# Altium schematic sheet DM2080_Connector_B.SchDoc: =project_title
size Tabloid; CompanyName: Luxonis Holding; Organization: Luxonis Holding; Address1: 1925 Harmony Park Drive; Address2: Westminster, CO; Address3: 80234; Address4: United States; SheetNumber: 3; SheetTotal: 12
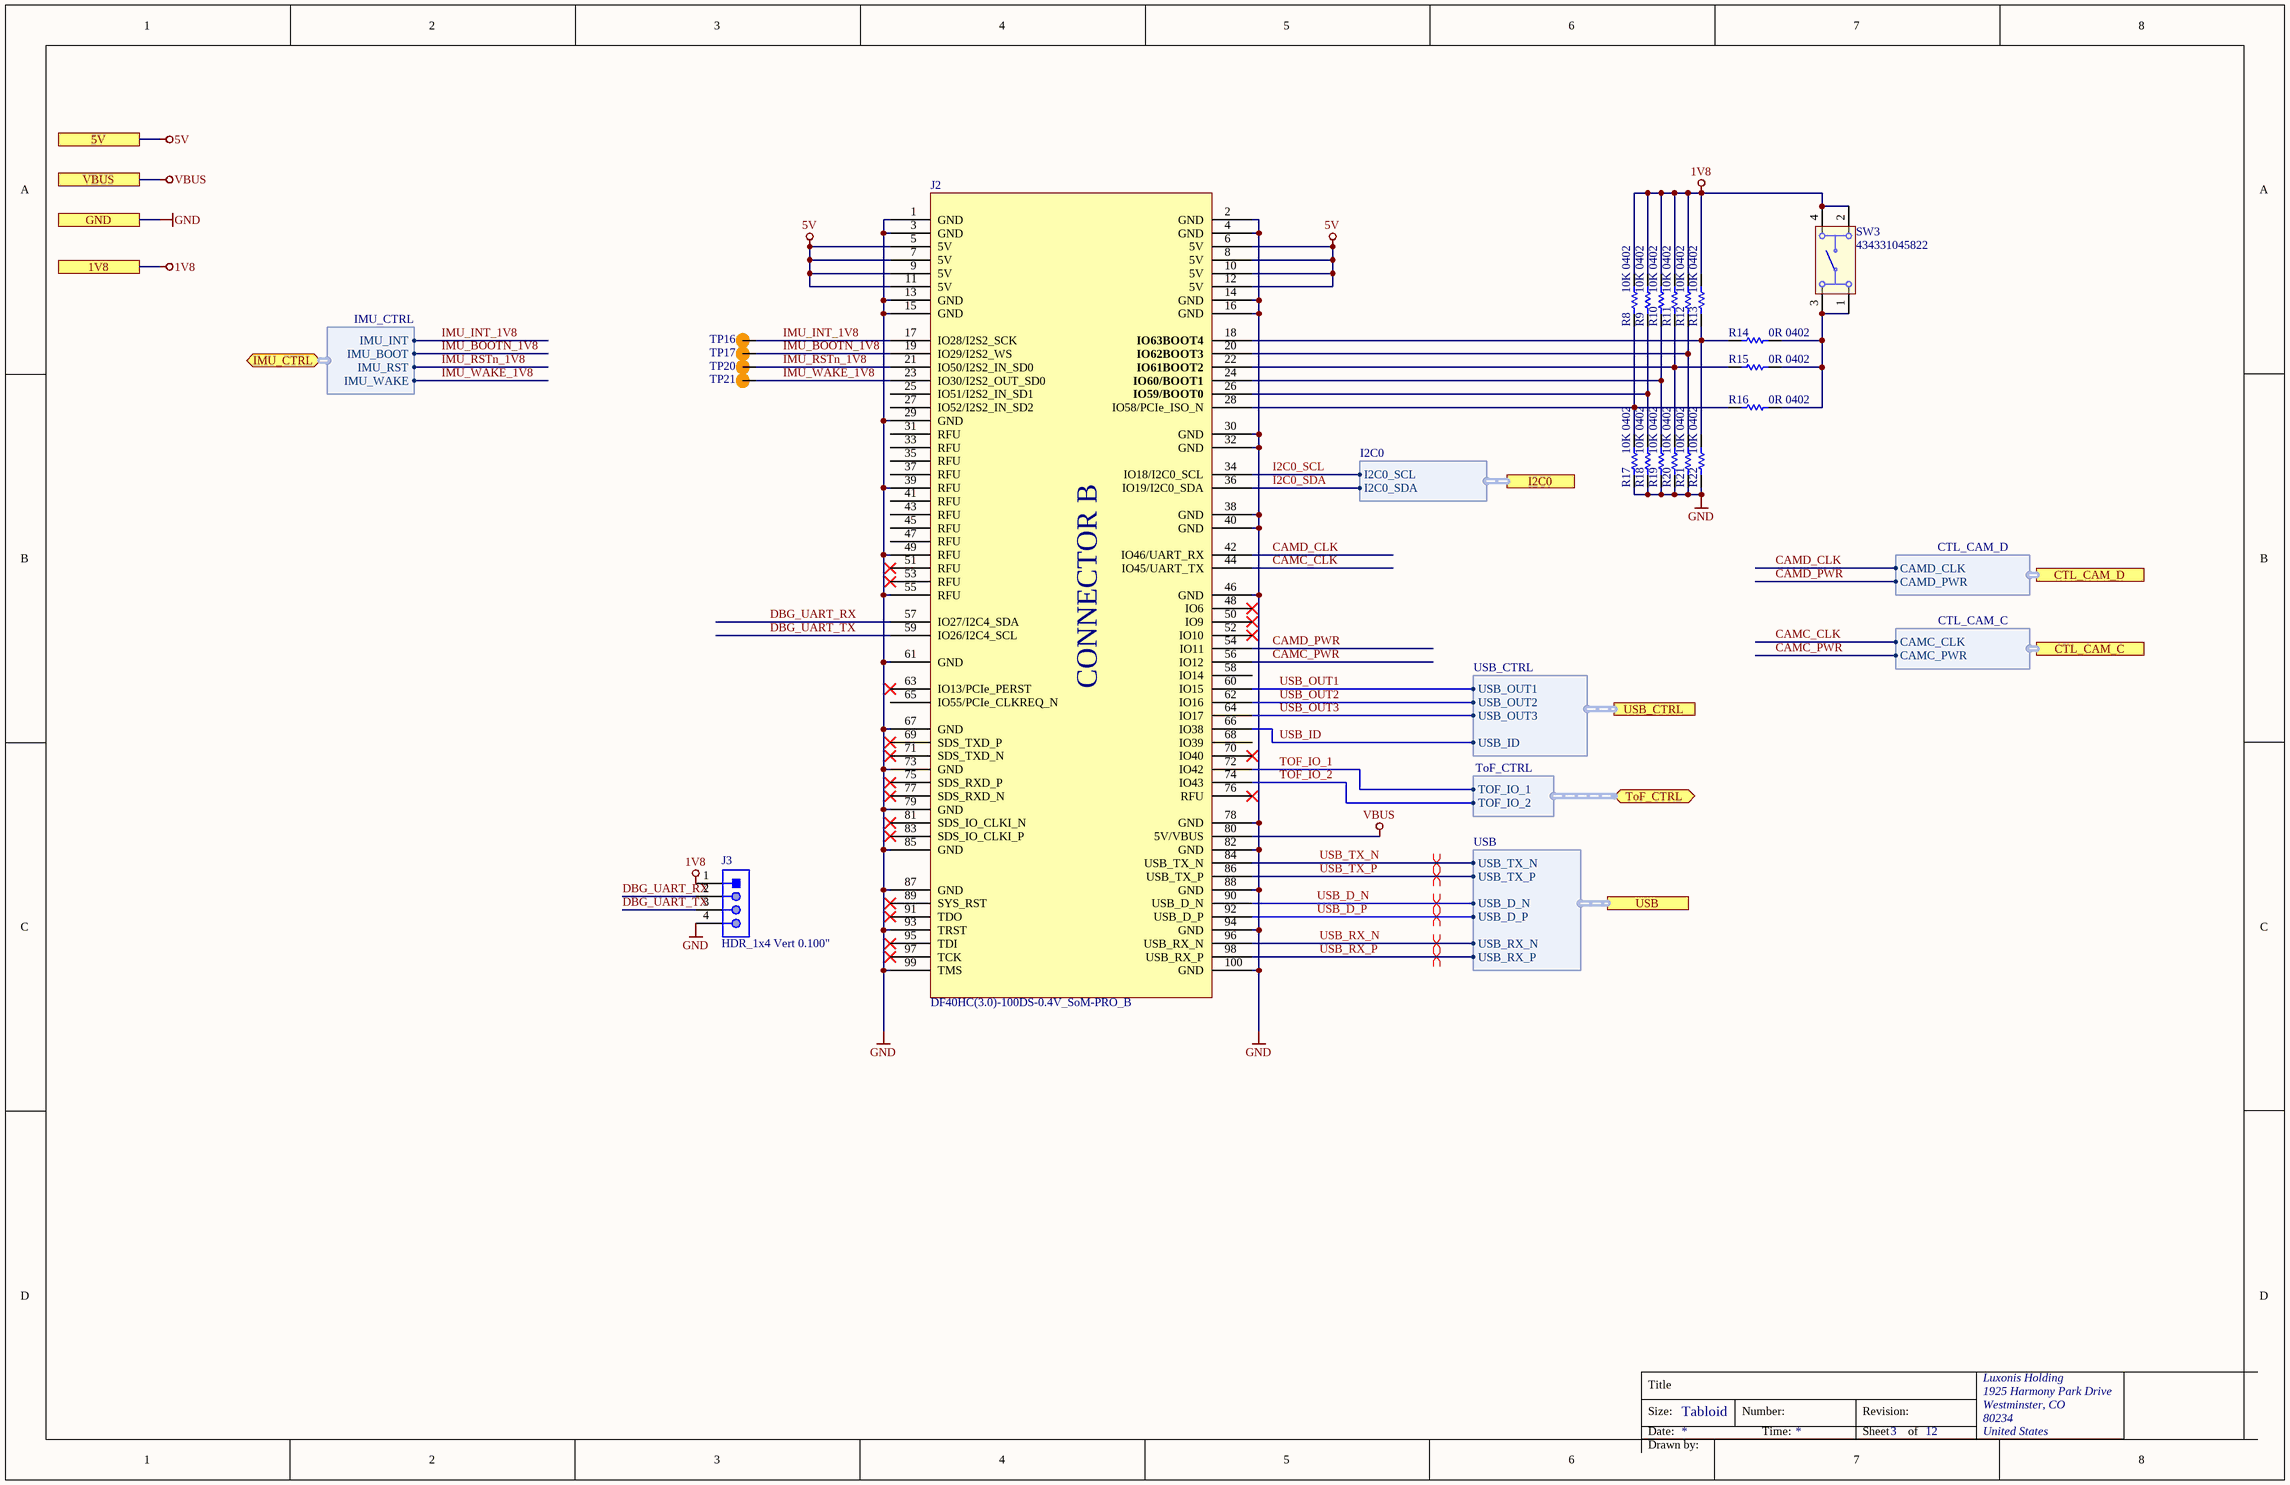
[diagram p0: DM2080_Connector_B.SchDoc]

## Parts
J2  DF40HC(3.0)-100DS-0.4V_SoM-PRO_B  [CON_B_BW2099_SoM_DF40HC-3.0-100DS-0.4V_minpad]
J3  HDR_1x4 Vert 0.100"  [61300411121]
R8  10K 0402  [RESC0402(1005)_L]
R9  10K 0402  [RESC0402(1005)_L]
R10  10K 0402  [RESC0402(1005)_L]
R11  10K 0402  [RESC0402(1005)_L]
R12  10K 0402  [RESC0402(1005)_L]
R13  10K 0402  [RESC0402(1005)_L]
R14  0R 0402  [RESC0402(1005)_L]
R15  0R 0402  [RESC0402(1005)_L]
R16  0R 0402  [RESC0402(1005)_L]
R17  10K 0402  [RESC0402(1005)_L]
R18  10K 0402  [RESC0402(1005)_L]
R19  10K 0402  [RESC0402(1005)_L]
R20  10K 0402  [RESC0402(1005)_L]
R21  10K 0402  [RESC0402(1005)_L]
R22  10K 0402  [RESC0402(1005)_L]
SW3  434331045822  [434331045822]
TP16  TP100_200_NS  [TP100_200_NS]  (value not drawn)  (no BOM)
TP17  TP100_200_NS  [TP100_200_NS]  (value not drawn)  (no BOM)
TP20  TP100_200_NS  [TP100_200_NS]  (value not drawn)  (no BOM)
TP21  TP100_200_NS  [TP100_200_NS]  (value not drawn)  (no BOM)

## Ports
1V8, 5V, CTL_CAM_C (harness CTL_CAM_C), CTL_CAM_D (harness CTL_CAM_D), GND, I2C0 (harness I2C0), IMU_CTRL (bidir, harness IMU_CTRL), ToF_CTRL (bidir, harness ToF_CTRL), USB (harness USB), USB_CTRL (harness USB_CTRL), VBUS

## Harnesses
USB: USB_D_P, USB_D_N, USB_TX_N, USB_TX_P, USB_RX_N, USB_RX_P
I2C0: I2C0_SDA, I2C0_SCL
ToF_CTRL: TOF_IO_1, TOF_IO_2
USB_CTRL: USB_OUT1, USB_OUT2, USB_OUT3, USB_ID
CTL_CAM_D: CAMD_PWR, CAMD_CLK
CTL_CAM_C: CAMC_PWR, CAMC_CLK
IMU_CTRL: IMU_BOOT, IMU_RST, IMU_INT, IMU_WAKE

## Nets
1V8: J3.1 R8.2 R9.2 R10.2 R11.2 R12.2 R13.2 SW3.2 SW3.4 ; port 1V8
5V: J2.5(5V) J2.6(5V) J2.7(5V) J2.8(5V) J2.9(5V) J2.10(5V) J2.11(5V) J2.12(5V) ; port 5V
GND: J2.1(GND) J2.2(GND) J2.3(GND) J2.4(GND) J2.13(GND) J2.14(GND) J2.15(GND) J2.16(GND) J2.29(GND) J2.30(GND) J2.32(GND) J2.38(GND) J2.39(RFU) J2.40(GND) J2.46(GND) J2.49(RFU) J2.55(RFU) J2.61(GND) J2.67(GND) J2.73(GND) J2.78(GND) J2.79(GND) J2.82(GND) J2.85(GND) J2.87(GND) J2.88(GND) J2.93(TRST) J2.94(GND) J2.99(TMS) J2.100(GND) J3.4 R17.1 R18.1 R19.1 R20.1 R21.1 R22.1 ; port GND
VBUS: J2.80(5V/VBUS) ; port VBUS
CAMC_CLK: J2.44(IO45/UART_TX) ; port CTL_CAM_C.CAMC_CLK
CAMC_PWR: J2.56(IO12) ; port CTL_CAM_C.CAMC_PWR
CAMD_CLK: J2.42(IO46/UART_RX) ; port CTL_CAM_D.CAMD_CLK
CAMD_PWR: J2.54(IO11) ; port CTL_CAM_D.CAMD_PWR
DBG_UART_RX: J2.57(IO27/I2C4_SDA) J3.2
DBG_UART_TX: J2.59(IO26/I2C4_SCL) J3.3
I2C0_SCL: J2.34(IO18/I2C0_SCL) ; port I2C0.I2C0_SCL
I2C0_SDA: J2.36(IO19/I2C0_SDA) ; port I2C0.I2C0_SDA
IMU_BOOTN_1V8: J2.19(IO29/I2S2_WS) TP17.1 ; port IMU_CTRL.IMU_BOOT
IMU_INT_1V8: J2.17(IO28/I2S2_SCK) TP16.1 ; port IMU_CTRL.IMU_INT
IMU_RSTn_1V8: J2.21(IO50/I2S2_IN_SD0) TP20.1 ; port IMU_CTRL.IMU_RST
IMU_WAKE_1V8: J2.23(IO30/I2S2_OUT_SD0) TP21.1 ; port IMU_CTRL.IMU_WAKE
TOF_IO_1: J2.72(IO42) ; port ToF_CTRL.TOF_IO_1
TOF_IO_2: J2.74(IO43) ; port ToF_CTRL.TOF_IO_2
USB_D_N: J2.90(USB_D_N) ; port USB.USB_D_N
USB_D_P: J2.92(USB_D_P) ; port USB.USB_D_P
USB_ID: J2.66(IO38) ; port USB_CTRL.USB_ID
USB_OUT1: J2.60(IO15) ; port USB_CTRL.USB_OUT1
USB_OUT2: J2.62(IO16) ; port USB_CTRL.USB_OUT2
USB_OUT3: J2.64(IO17) ; port USB_CTRL.USB_OUT3
USB_RX_N: J2.96(USB_RX_N) ; port USB.USB_RX_N
USB_RX_P: J2.98(USB_RX_P) ; port USB.USB_RX_P
USB_TX_N: J2.84(USB_TX_N) ; port USB.USB_TX_N
USB_TX_P: J2.86(USB_TX_P) ; port USB.USB_TX_P
NetJ2_18: J2.18(IO63BOOT4) R13.1 R14.2 R22.2
NetJ2_20: J2.20(IO62BOOT3) R12.1 R21.2
NetJ2_22: J2.22(IO61BOOT2) R11.1 R15.2 R20.2
NetJ2_24: J2.24(IO60/BOOT1) R10.1 R19.2
NetJ2_26: J2.26(IO59/BOOT0) R9.1 R18.2
NetJ2_28: J2.28(IO58/PCIe_ISO_N) R8.1 R16.2 R17.2
NetR14_1: R14.1 R15.1 R16.1 SW3.1 SW3.3

Not connected (* = marked no-connect by the designer): J2 25(IO51/I2S2_IN_SD1) 27(IO52/I2S2_IN_SD2) 31(RFU) 33(RFU) 35(RFU) 37(RFU) 41(RFU) 43(RFU) 45(RFU) 47(RFU) 48(IO6)* 50(IO9)* 51(RFU)* 52(IO10)* 53(RFU)* 58(IO14) 63(IO13/PCIe_PERST)* 65(IO55/PCIe_CLKREQ_N) 68(IO39) 69(SDS_TXD_P)* 70(IO40)* 71(SDS_TXD_N)* 75(SDS_RXD_P)* 76(RFU)* 77(SDS_RXD_N)* 81(SDS_IO_CLKI_N)* 83(SDS_IO_CLKI_P)* 89(SYS_RST)* 91(TDO)* 95(TDI)* 97(TCK)*

## Layout directives
differential pair; differential pair class 90ohm: USB_D_N, USB_D_P, USB_RX_N, USB_RX_P, USB_TX_N, USB_TX_P

## Notes on the sheet
- Title
- Size:
- Date:
- Tabloid
- Number:
- Time:
- Revision:
- Sheet
- of
- Drawn by:
- (in symbol CMP-005-000053-4) CONNECTOR B

## Library data of the parts
J2 = CMP-005-000053-4: OAK-SoM-Pro base board conn. B; Manufacturer Part Number 1: DF40HC(3.0)-100DS-0.4V(58); Manufacturer 1: Hirose; Connector Type: Receptacle; Pitch: 0.016inch; Number of Positions: 100; System: Connector; Design Item ID: DF40HC(3.0)-100DS-0.4V_SoM-PRO_B; Stock 1: 2172; Stock 2: 2078; Contact Plating: Gold; Lead Free: Lead Free; Pricing 2: 1=2.50000, 10=2.40000, 25=2.10000, 50=2.10000, 100=2.00000, 250=1.76000, 500=1.71000, 1000=1.45000, 2000=1.36000, 5000=1.31000, 10000=1.31000 (USD); ComponentLink4Description: https://datasheet.ciiva.com/18562/ed-df40-20140305-18562462.pdf?src-supplier=Digi-Key; Mount: Surface Mount; Number of Rows: 2; ComponentLink1URL: https://datasheet.ciiva.com/46636/ed-df40-20140305-46636517.pdf?src-supplier=Digi-Key; ComponentLink2URL: https://datasheet.ciiva.com/18562/ed-df40-20140305-18562189.pdf?src-supplier=Digi-Key; ComponentLink4URL: https://datasheet.ciiva.com/18562/ed-df40-20140305-18562462.pdf?src-supplier=Digi-Key; Source: LuxonisMaster.SchLib; Pricing 1: 1=2.54000, 10=2.26000, 25=2.07000, 50=2.07000, 100=1.98000, 250=1.79000, 500=1.65000, 1000=1.41000, 3000=1.32000, 6000=1.23000, 10000=1.23000 (USD); ComponentLink2Description: https://datasheet.ciiva.com/18562/ed-df40-20140305-18562189.pdf?src-supplier=Digi-Key; RoHS: Yes; ComponentLink3URL: https://datasheet.ciiva.com/13559/ed-df40-20140305-13559540.pdf?src-supplier=Mouser; Package Quantity: 1000; Packaging: Tape and Reel; ComponentLink1Description: https://datasheet.ciiva.com/46636/ed-df40-20140305-46636517.pdf?src-supplier=Digi-Key; ComponentLink3Description: https://datasheet.ciiva.com/13559/ed-df40-20140305-13559540.pdf?src-supplier=Mouser
J3 = 61300411121: CONN HEADER VERT 4POS 2.54MM  Connector Header Through Hole 4 position 0.100" (2.54mm); Manufacturer 1: Wurth Electronics; Number of Positions: 4; Gender: Male; Connector Type: Male Pin; Pitch: 0.1inch; Supplier 1: Digi-Key; Manufacturer Part Number 1: 61300411121; Stock 1: 19594; Pricing 1: 1=0.18000, 10=0.15300, 25=0.12720, 50=0.10600, 100=0.09600, 1000=0.08800 (USD); RoHS: Yes; Mount: Through Hole; Contact Plating: Gold; Contact Material: Copper; Color: Black; Number of Rows: 1; Packaging: Bulk; Termination: Solder; Number of Contacts: 4; Contact Mating Length: 0.236inch; REACH SVHC: Unknown; Lead Free: Lead Free; ComponentLink1URL: http://www.farnell.com/cad/1737268.pdf?src-supplier=Element14; ComponentLink1Description: http://www.farnell.com/cad/1737268.pdf?src-supplier=Element14; ComponentLink2URL: https://katalog.we-online.de/em/datasheet/6130xx11121.pdf?src-supplier=Digi-Key; ComponentLink2Description: https://katalog.we-online.de/em/datasheet/6130xx11121.pdf?src-supplier=Digi-Key; Supplier Part Number 1: 732-5317-ND
R8-R13 R17-R22 = RC0402FR-1310KL: RES SMD 10K OHM 1% 0402 1/16W Chip Resistor, 0402 [1005 Metric], 10 kohm, RC Series, 50 V, Thick Film, 62.5 mW; Manufacturer 1: Yageo; Resistance: 10kR; Temperature Coefficient: 100ppm/°C; Power Rating: 62.5mW; Voltage Rating: 50V; ComponentLink1URL: https://datasheet.ciiva.com/16940/pyu-rc0402-51-rohs-l-6-16940293.pdf?src-supplier=Avnet+Europe; ComponentLink1Description: https://datasheet.ciiva.com/16940/pyu-rc0402-51-rohs-l-6-16940293.pdf?src-supplier=Avnet+Europe; ComponentLink2URL: https://datasheet.ciiva.com/28386/pyu-rc0402-51-rohs-l-6-28386855.pdf?src-supplier=Avnet+Europe; ComponentLink2Description: https://datasheet.ciiva.com/28386/pyu-rc0402-51-rohs-l-6-28386855.pdf?src-supplier=Avnet+Europe; ComponentLink3URL: https://datasheet.ciiva.com/16740/pyu-rc0402-51-rohs-l-6-r-16740602.pdf?src-supplier=Future+Electronics; ComponentLink3Description: https://datasheet.ciiva.com/16740/pyu-rc0402-51-rohs-l-6-r-16740602.pdf?src-supplier=Future+Electronics; ComponentLink4URL: https://datasheet.ciiva.com/8891/pyu-rc0402-51-rohs-l-6-8891339.pdf?src-supplier=Avnet; ComponentLink4Description: https://datasheet.ciiva.com/8891/pyu-rc0402-51-rohs-l-6-8891339.pdf?src-supplier=Avnet; ComponentLink5URL: https://datasheet.ciiva.com/5557/pyu-rc0402-51-rohs-l-6-r-5557997.pdf?src-supplier=Mouser; ComponentLink5Description: https://datasheet.ciiva.com/5557/pyu-rc0402-51-rohs-l-6-r-5557997.pdf?src-supplier=Mouser; ComponentLink6URL: https://datasheet.ciiva.com/7983/1018594-7983533.pdf?src-supplier=Element14; ComponentLink6Description: https://datasheet.ciiva.com/7983/1018594-7983533.pdf?src-supplier=Element14; Supplier 1: Newark; Manufacturer Part Number 1: RC0402FR-1310KL; Stock 1: 62239; Pricing 1: 1=0.10000, 25=0.01200, 100=0.00400, 250=0.00400, 500=0.00300, 1000=0.00300 (USD); RoHS: Yes; Case/Package: 0402; Number of Pins: 2; Contact Plating: Tin,Matte,Lead; Case Code (Imperial): 0402; Case Code (Metric): 1005; Min Operating Temperature: -55°C; Max Operating Temperature: 155°C; Tolerance: 1%; Composition: Thick Film; Packaging: Tape and Reel; Termination: SMD/SMT; Military Standard: Not; Voltage Rating (DC): 50V; Working Voltage: 50V; Number of Terminations: 2; Length: 1mm; Depth: 0.5mm; Radiation Hardening: No; REACH SVHC: No SVHC; Lead Free: Lead Free; Supplier Part Number 1: 67R9960; Supplier 2: Future Electronics; Supplier 3: Mouser; Supplier 4: Element14; Supplier Part Number 2: RC0402FR-1310KL-CUTT; Supplier Part Number 3: 603-RC0402FR-1310KL; Supplier Part Number 4: 1799235
R14-R16 = CRCW04020000Z0ED: RES SMD 0 OHM JUMPER 1/16W 0402; Manufacturer 1: Vishay; Resistance: 0mR; Power Rating: 63mW; Voltage Rating: 50V; Temperature Coefficient: 100ppm/°C; Tolerance: 5%; Manufacturer Part Number 1: CRCW04020000Z0ED; Supplier 1: Digi-Key; Stock 1: 855968; Pricing 1: 1=0.10000, 10=0.03400, 25=0.02440, 50=0.01860, 100=0.01380, 250=0.01048, 500=0.00840, 1000=0.00618, 5000=0.00443 (USD); RoHS: Yes; Mount: Surface Mount; Case/Package: 0402; Weight: 2.3E-05oz; Case Code (Imperial): 0402; Case Code (Metric): 1005; Contact Plating: Tin; Min Operating Temperature: -55°C; Max Operating Temperature: 155°C; Packaging: Tape and Reel; Composition: Thick Film; Voltage Rating (DC): 50V; Package Quantity: 1; Termination: SMD/SMT; Number of Terminations: 2; Military Standard: Not; Max Power Dissipation: 63mW; Features: Automotive AEC-Q200; Length: 1mm; Height: 0.35mm; Width: 0.5mm; Depth: 0.5mm; Radiation Hardening: No; REACH SVHC: Unknown; Lead Free: Lead Free; ComponentLink1URL: https://datasheet.ciiva.com/3255/dcrcwe3-3255944.pdf?src-supplier=Avnet; ComponentLink1Description: https://datasheet.ciiva.com/3255/dcrcwe3-3255944.pdf?src-supplier=Avnet; ComponentLink2URL: https://datasheet.ciiva.com/3255/dcrcwe3-3255945.pdf?src-supplier=Avnet; ComponentLink2Description: https://datasheet.ciiva.com/3255/dcrcwe3-3255945.pdf?src-supplier=Avnet; ComponentLink3URL: https://datasheet.ciiva.com/16881/dcrcwe3-16881413.pdf?src-supplier=Avnet+Europe; ComponentLink3Description: https://datasheet.ciiva.com/16881/dcrcwe3-16881413.pdf?src-supplier=Avnet+Europe; ComponentLink4URL: https://datasheet.ciiva.com/2461/dcrcwe3-2461962.pdf?src-supplier=Digi-Key; ComponentLink4Description: https://datasheet.ciiva.com/2461/dcrcwe3-2461962.pdf?src-supplier=Digi-Key; ComponentLink5URL: https://datasheet.ciiva.com/7841/1720486-7841802.pdf?src-supplier=Element14; ComponentLink5Description: https://datasheet.ciiva.com/7841/1720486-7841802.pdf?src-supplier=Element14; ComponentLink6URL: https://datasheet.ciiva.com/2461/dcrcwe3-2461963.pdf?src-supplier=Digi-Key; ComponentLink6Description: https://datasheet.ciiva.com/2461/dcrcwe3-2461963.pdf?src-supplier=Digi-Key; ComponentLink7URL: https://datasheet.ciiva.com/2461/dcrcwe3-2461964.pdf?src-supplier=Digi-Key; ComponentLink7Description: https://datasheet.ciiva.com/2461/dcrcwe3-2461964.pdf?src-supplier=Digi-Key; ComponentLink8URL: https://datasheet.ciiva.com/7841/1697337-7841468.pdf?src-supplier=Element14; ComponentLink8Description: https://datasheet.ciiva.com/7841/1697337-7841468.pdf?src-supplier=Element14; ComponentLink9URL: https://datasheet.ciiva.com/16761/70200976-16761309.pdf?src-supplier=Allied+Electronics; ComponentLink9Description: https://datasheet.ciiva.com/16761/70200976-16761309.pdf?src-supplier=Allied+Electronics; ComponentLink10URL: https://datasheet.ciiva.com/26311/fld-crcw-e3-data-en-26311550.pdf?src-supplier=Distrelec; ComponentLink10Description: https://datasheet.ciiva.com/26311/fld-crcw-e3-data-en-26311550.pdf?src-supplier=Distrelec; Supplier Part Number 1: 541-0.0JCT-ND
SW3 = CMP-011-00016-3: Keypad Switch, 1 Switches, SPST, Momentary-tactile, 0.05A, 12VDC, 2.65N, Solder Terminal, Surface Mount-right Angle; Manufacturer 1: Wurth Electronics; Voltage Rating: 12V; Max Current Rating: 50mA; Throw Configuration: SPST-NO; Supplier Part Number 1: 732-7055-2-ND; Manufacturer part number 1: 434331045822; Pins: 4; Supplier 1: Digi-Key; Current Rating: 50mA; Mounting Technology: SMD; Case/Package: 434331045822
TP16 TP17 TP20 TP21 = TEST_POINT